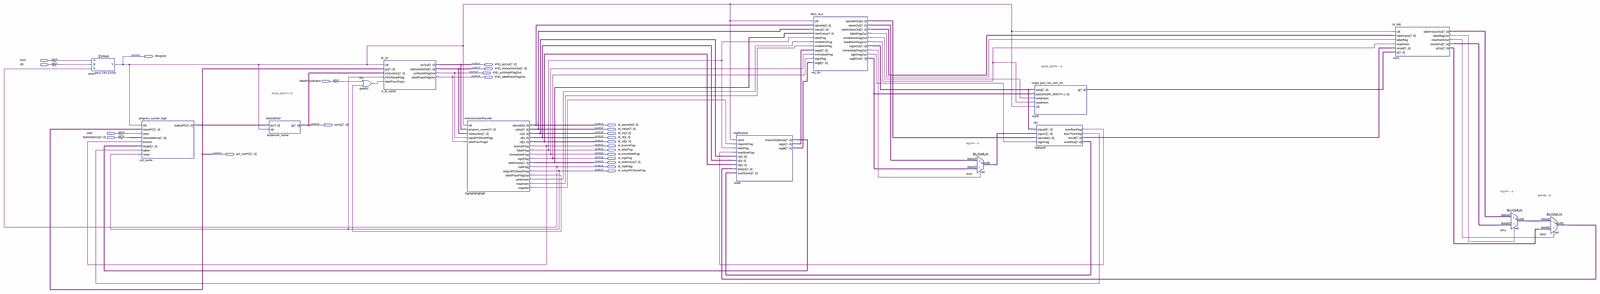
[diagram p0: schematic sheet, whole]
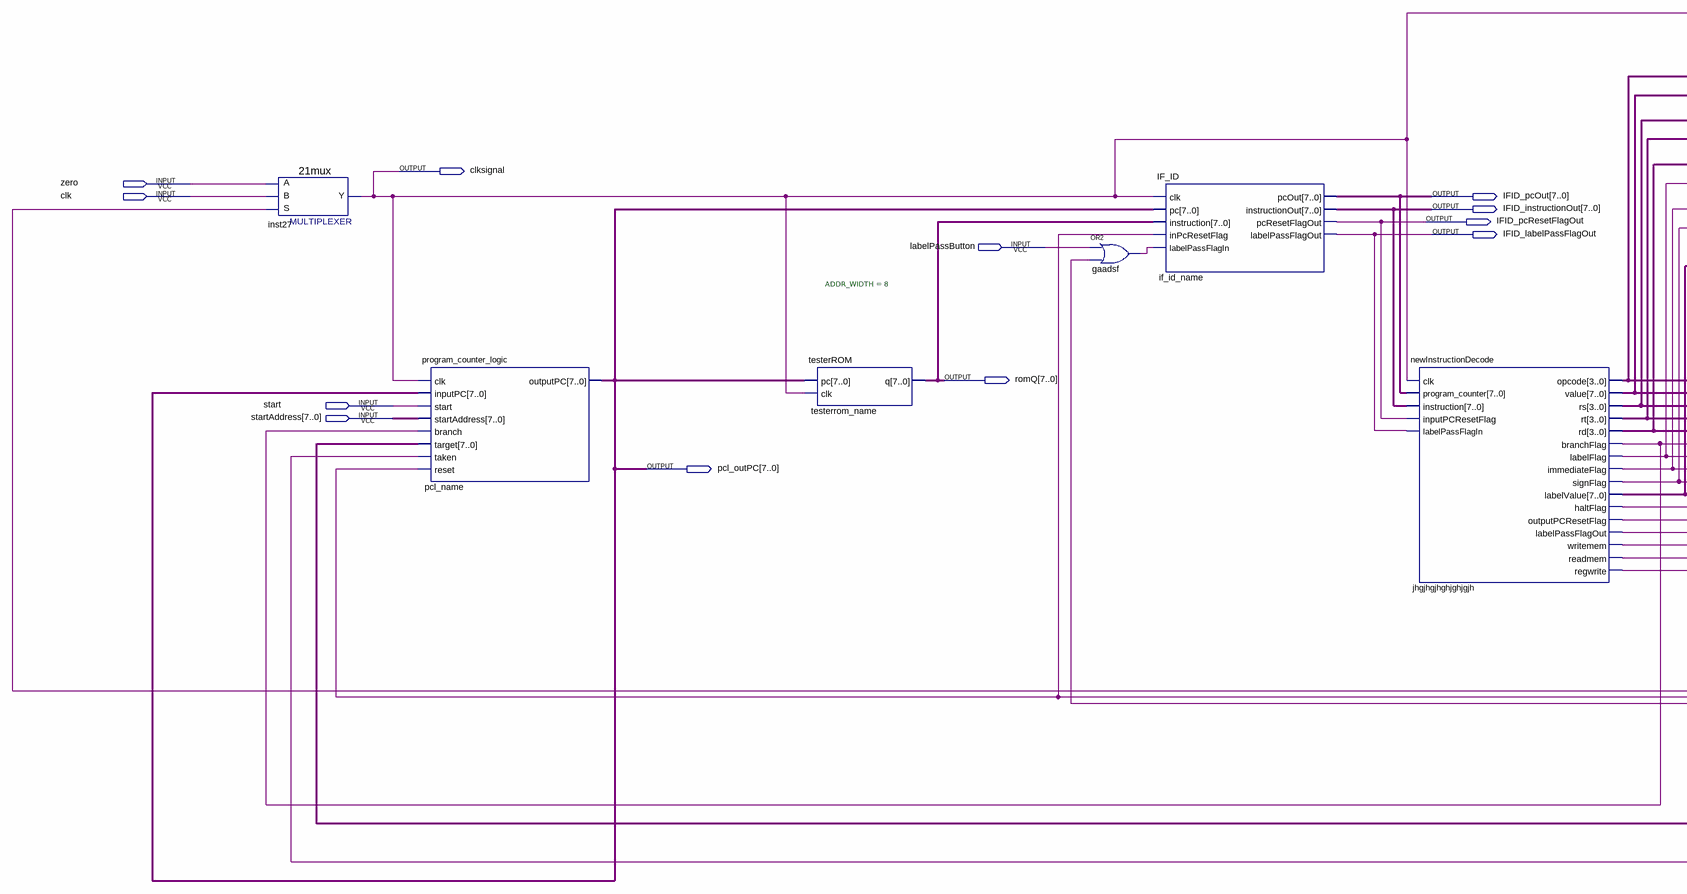
[diagram p1: schematic sheet, left part]
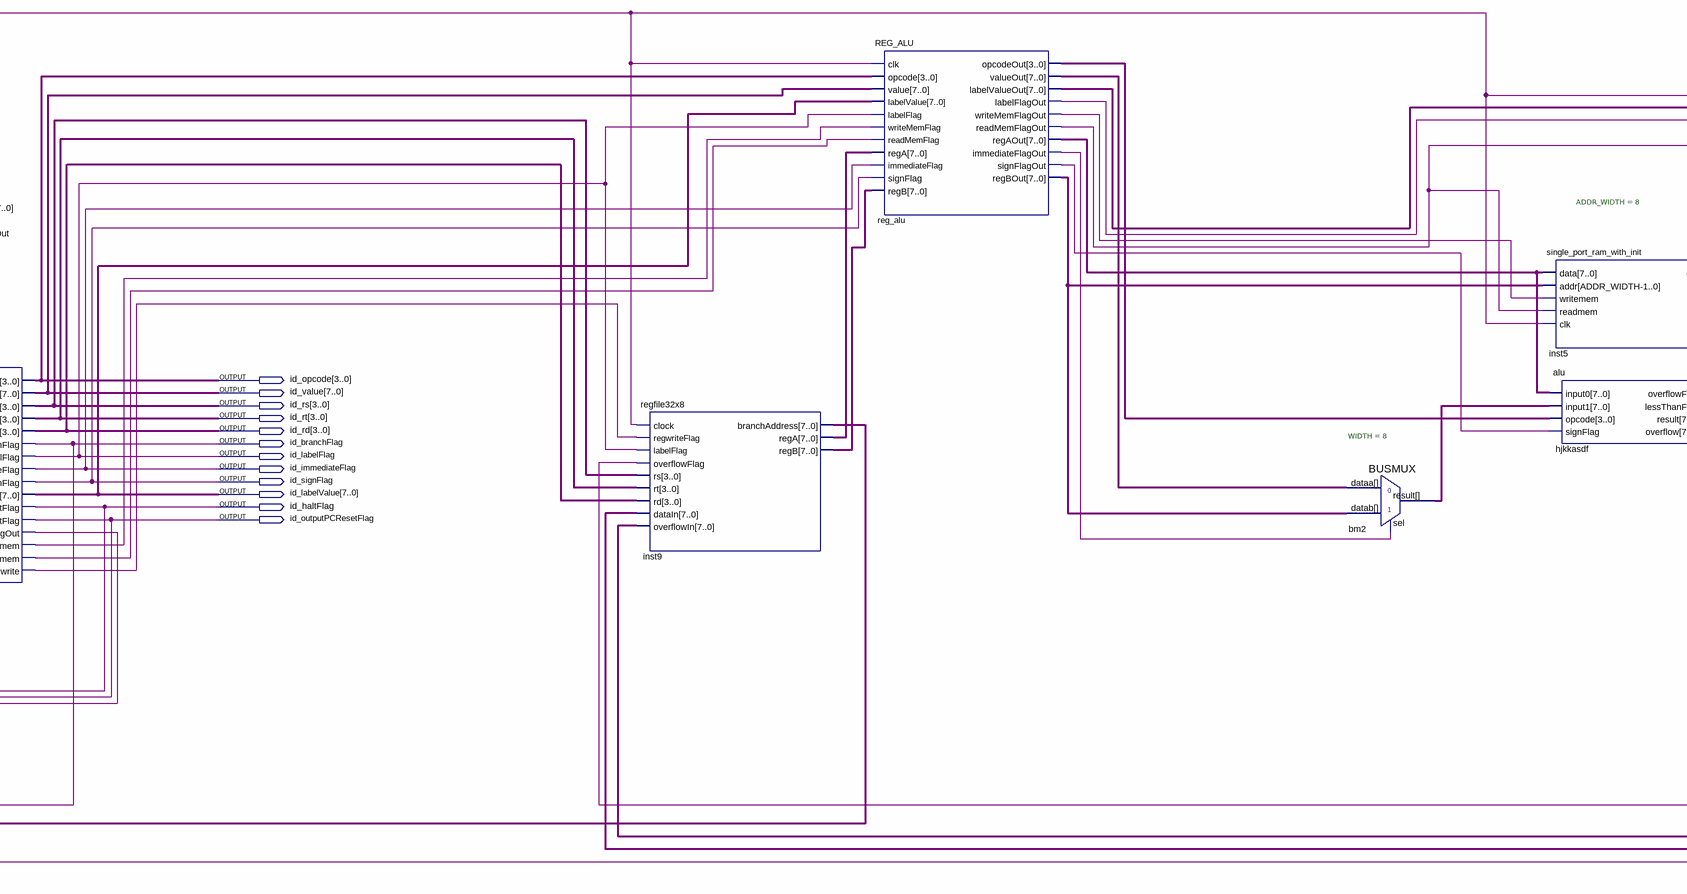
[diagram p2: schematic sheet, centre part]
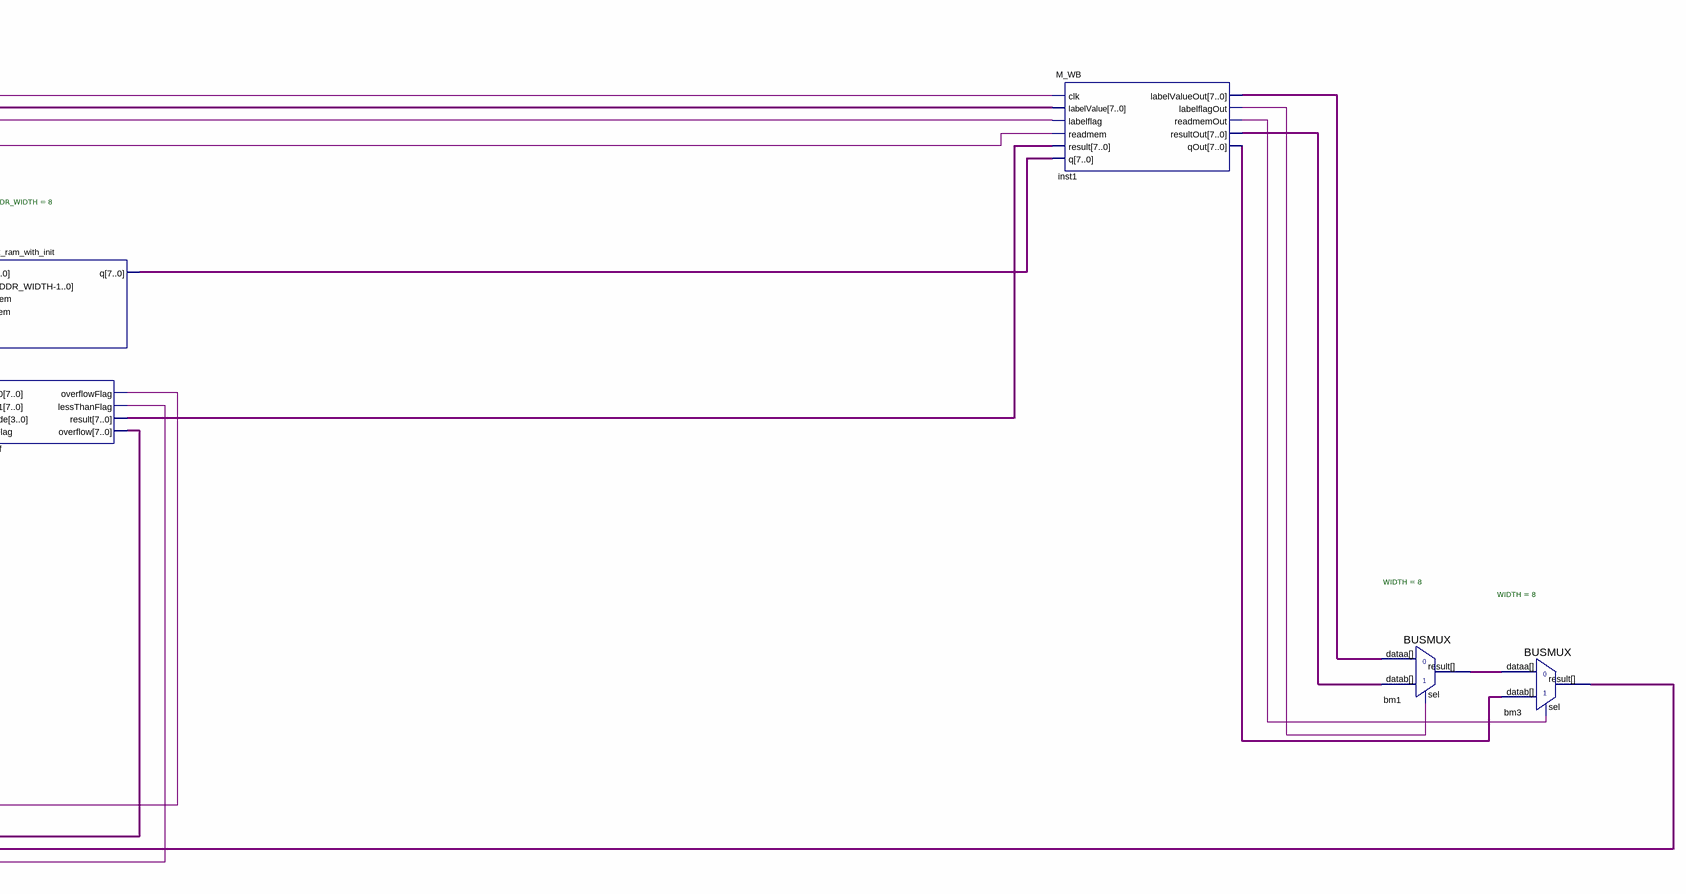
[diagram p3: schematic sheet, right part]
// Quartus schematic CS141L.bdf as structural Verilog: 14 symbols, 24 pins
module CS141L (
  input  zero,
  input  clk,
  input  labelPassButton,
  input  start,
  input  [7:0] startAddress,
  output clksignal,
  output [7:0] IFID_pcOut,
  output [7:0] IFID_instructionOut,
  output IFID_pcResetFlagOut,
  output IFID_labelPassFlagOut,
  output [7:0] romQ,
  output [3:0] id_opcode,
  output [7:0] id_value,
  output [3:0] id_rs,
  output [3:0] id_rt,
  output [3:0] id_rd,
  output id_branchFlag,
  output id_labelFlag,
  output [7:0] pcl_outPC,
  output id_immediateFlag,
  output id_signFlag,
  output [7:0] id_labelValue,
  output id_haltFlag,
  output id_outputPCResetFlag
);

  wire gaadsf_out, hjkkasdf_lessthanflag, hjkkasdf_overflowflag, inst1_labelflagout, inst1_readmemout,
       jhgjhgjhghjghjgjh_labelpassflagout, jhgjhgjhghjghjgjh_readmem, jhgjhgjhghjghjgjh_regwrite,
       jhgjhgjhghjghjgjh_writemem, reg_alu_immediateflagout, reg_alu_labelflagout, reg_alu_readmemflagout,
       reg_alu_signflagout, reg_alu_writememflagout;
  wire [3:0] reg_alu_opcodeout;
  wire [7:0] bm1_result, bm2_result, bm3_result, hjkkasdf_overflow, hjkkasdf_result, inst1_labelvalueout,
       inst1_qout, inst1_resultout, inst5_q, inst9_branchaddress, inst9_rega, inst9_regb,
       reg_alu_labelvalueout, reg_alu_regaout, reg_alu_regbout, reg_alu_valueout;

  \21mux  inst27 (.S(id_haltFlag), .B(clk), .A(zero), .Y(clksignal));
  program_counter_logic pcl_name (
    .clk(clksignal), .inputPC(pcl_outPC), .start(start), .startAddress(startAddress), .branch(id_branchFlag),
    .target(inst9_branchaddress), .taken(hjkkasdf_lessthanflag), .reset(id_outputPCResetFlag),
    .outputPC(pcl_outPC));
  testerROM #(.ADDR_WIDTH(8)) testerrom_name (.pc(pcl_outPC), .clk(clksignal), .q(romQ));
  or gaadsf (gaadsf_out, labelPassButton, jhgjhgjhghjghjgjh_labelpassflagout);
  IF_ID if_id_name (
    .clk(clksignal), .pc(pcl_outPC), .instruction(romQ), .inPcResetFlag(id_outputPCResetFlag),
    .labelPassFlagIn(gaadsf_out), .pcOut(IFID_pcOut), .instructionOut(IFID_instructionOut),
    .pcResetFlagOut(IFID_pcResetFlagOut), .labelPassFlagOut(IFID_labelPassFlagOut));
  newInstructionDecode jhgjhgjhghjghjgjh (
    .clk(clksignal), .program_counter(IFID_pcOut), .instruction(IFID_instructionOut),
    .inputPCResetFlag(IFID_pcResetFlagOut), .labelPassFlagIn(IFID_labelPassFlagOut), .opcode(id_opcode),
    .value(id_value), .rs(id_rs), .rt(id_rt), .rd(id_rd), .branchFlag(id_branchFlag),
    .labelFlag(id_labelFlag), .immediateFlag(id_immediateFlag), .signFlag(id_signFlag),
    .labelValue(id_labelValue), .haltFlag(id_haltFlag), .outputPCResetFlag(id_outputPCResetFlag),
    .labelPassFlagOut(jhgjhgjhghjghjgjh_labelpassflagout), .writemem(jhgjhgjhghjghjgjh_writemem),
    .readmem(jhgjhgjhghjghjgjh_readmem), .regwrite(jhgjhgjhghjghjgjh_regwrite));
  regfile32x8 inst9 (
    .clock(clksignal), .regwriteFlag(jhgjhgjhghjghjgjh_regwrite), .labelFlag(id_labelFlag),
    .overflowFlag(hjkkasdf_overflowflag), .rs(id_rs), .rt(id_rt), .rd(id_rd), .dataIn(bm3_result),
    .overflowIn(hjkkasdf_overflow), .branchAddress(inst9_branchaddress), .regA(inst9_rega), .regB(inst9_regb));
  REG_ALU reg_alu (
    .clk(clksignal), .opcode(id_opcode), .value(id_value), .labelValue(id_labelValue),
    .labelFlag(id_labelFlag), .writeMemFlag(jhgjhgjhghjghjgjh_writemem),
    .readMemFlag(jhgjhgjhghjghjgjh_readmem), .regA(inst9_rega), .immediateFlag(id_immediateFlag),
    .signFlag(id_signFlag), .regB(inst9_regb), .opcodeOut(reg_alu_opcodeout), .valueOut(reg_alu_valueout),
    .labelValueOut(reg_alu_labelvalueout), .labelFlagOut(reg_alu_labelflagout),
    .writeMemFlagOut(reg_alu_writememflagout), .readMemFlagOut(reg_alu_readmemflagout),
    .regAOut(reg_alu_regaout), .immediateFlagOut(reg_alu_immediateflagout),
    .signFlagOut(reg_alu_signflagout), .regBOut(reg_alu_regbout));
  BUSMUX #(.WIDTH(8)) bm2 (
    .datab(reg_alu_regbout), .sel(reg_alu_immediateflagout), .dataa(reg_alu_valueout), .result(bm2_result));
  single_port_ram_with_init #(.ADDR_WIDTH(8)) inst5 (
    .data(reg_alu_regaout), .addr(reg_alu_regbout), .writemem(reg_alu_writememflagout),
    .readmem(reg_alu_readmemflagout), .clk(clksignal), .q(inst5_q));
  alu hjkkasdf (
    .input0(reg_alu_regaout), .input1(bm2_result), .opcode(reg_alu_opcodeout),
    .signFlag(reg_alu_signflagout), .overflowFlag(hjkkasdf_overflowflag),
    .lessThanFlag(hjkkasdf_lessthanflag), .result(hjkkasdf_result), .overflow(hjkkasdf_overflow));
  M_WB inst1 (
    .clk(clksignal), .labelValue(reg_alu_labelvalueout), .labelflag(reg_alu_labelflagout),
    .readmem(reg_alu_readmemflagout), .result(hjkkasdf_result), .q(inst5_q),
    .labelValueOut(inst1_labelvalueout), .labelflagOut(inst1_labelflagout), .readmemOut(inst1_readmemout),
    .resultOut(inst1_resultout), .qOut(inst1_qout));
  BUSMUX #(.WIDTH(8)) bm1 (
    .datab(inst1_resultout), .sel(inst1_labelflagout), .dataa(inst1_labelvalueout), .result(bm1_result));
  BUSMUX #(.WIDTH(8)) bm3 (.datab(inst1_qout), .sel(inst1_readmemout), .dataa(bm1_result), .result(bm3_result));
endmodule
